# Altium schematic sheet AirLP.SchDoc
size A3
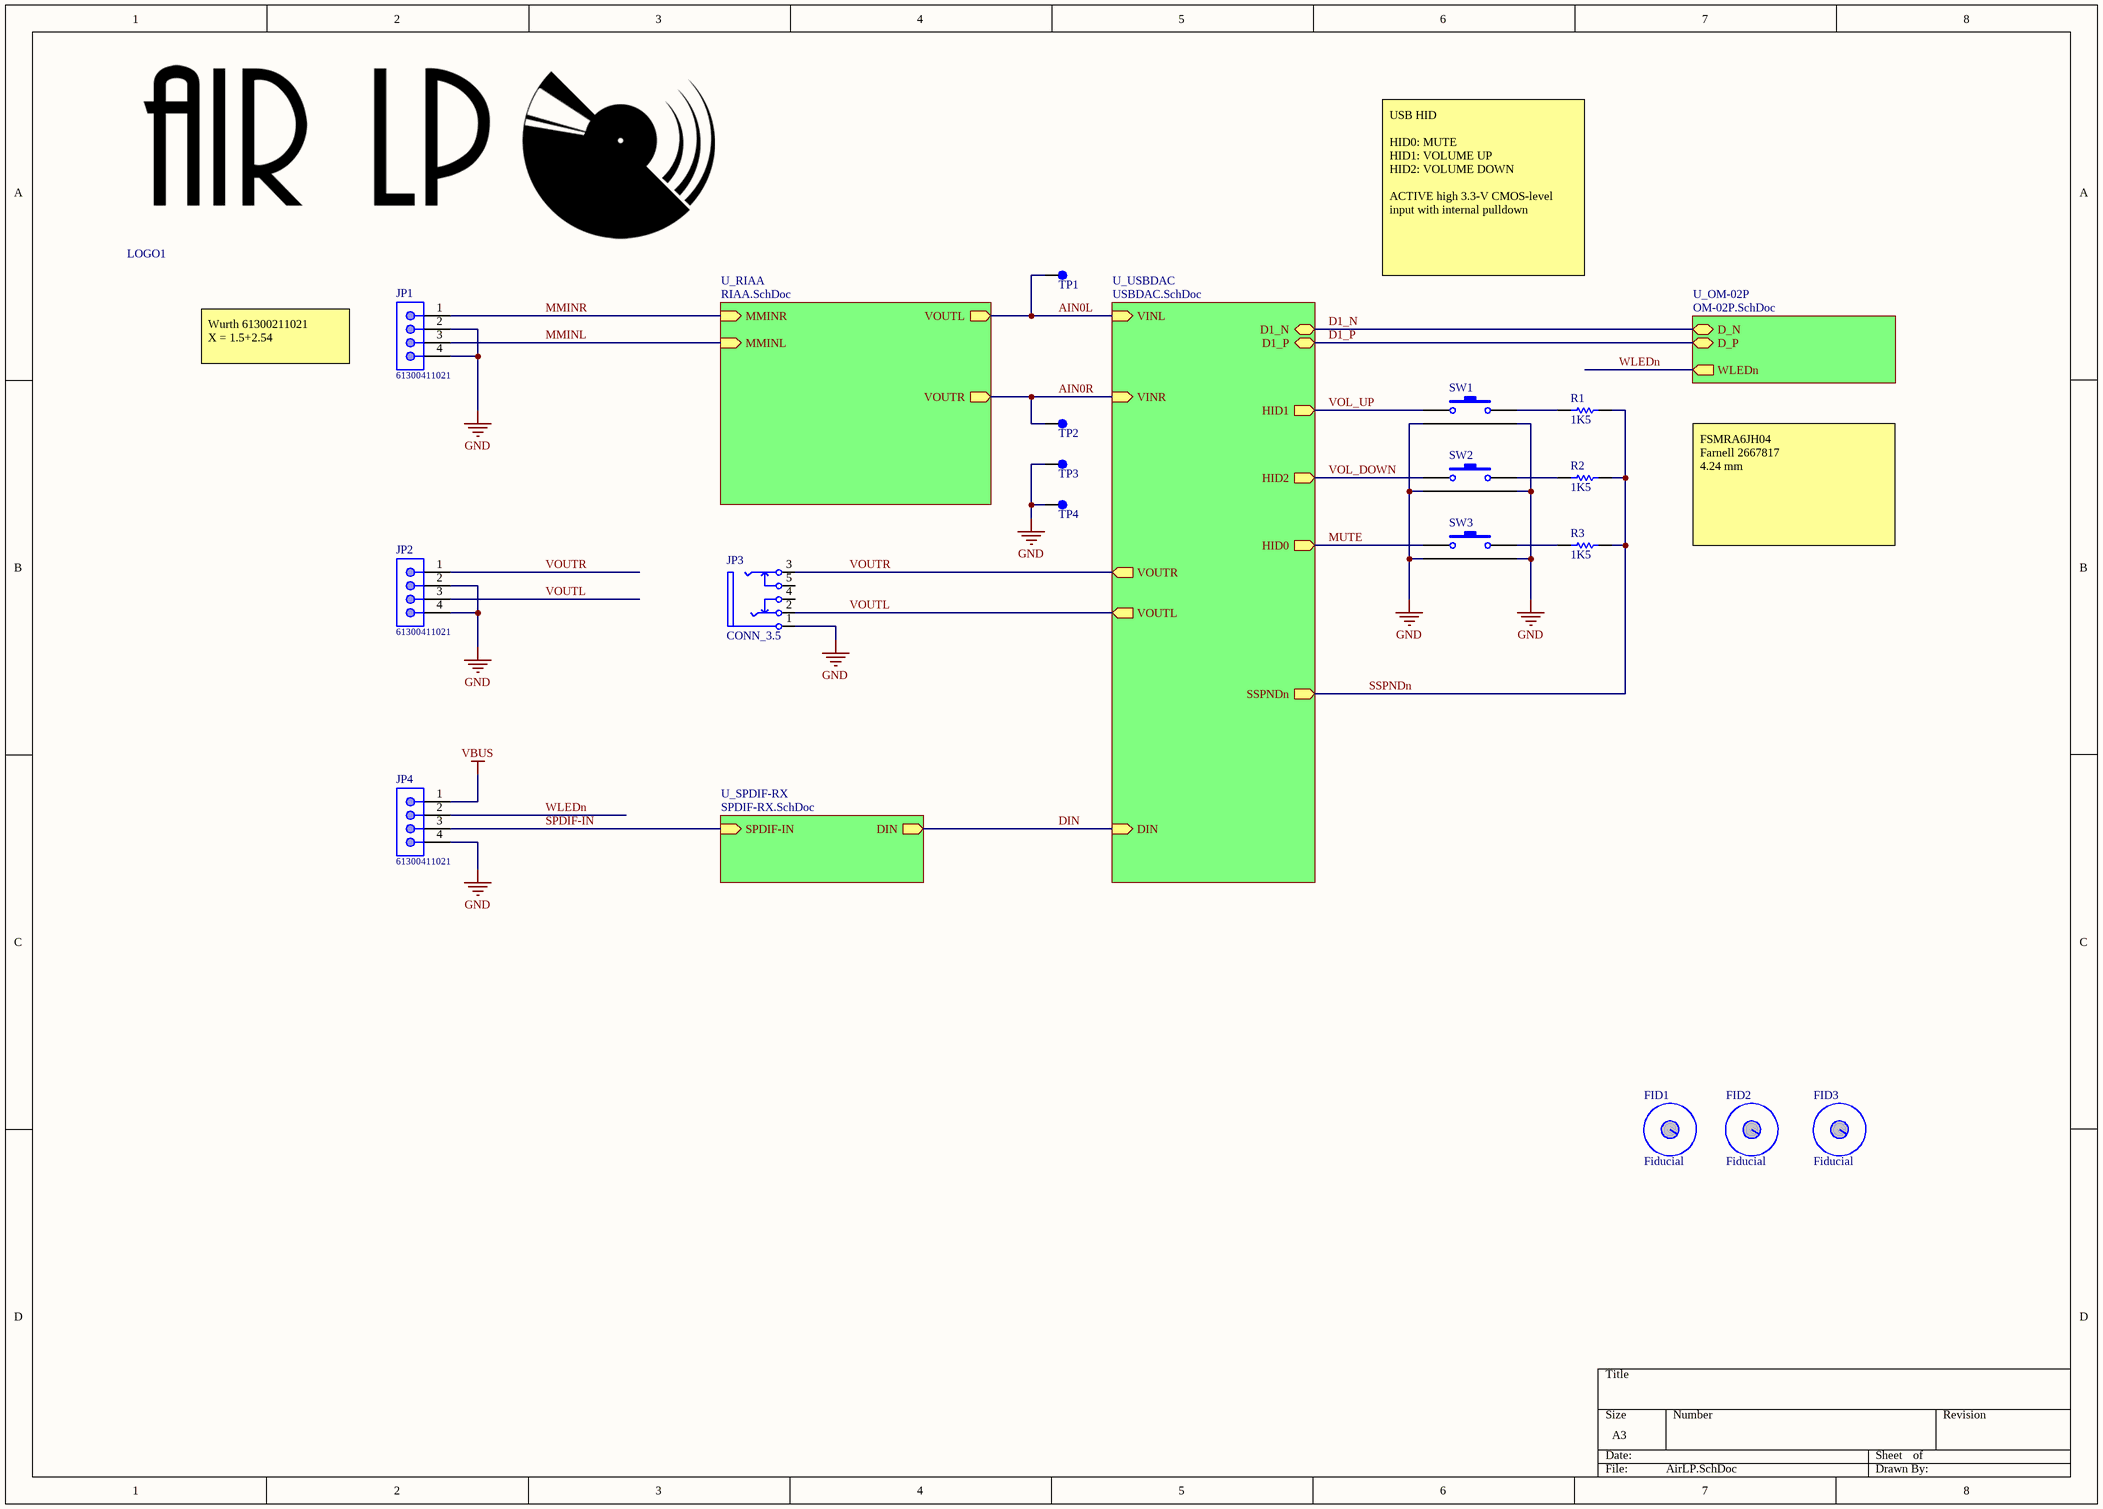
[diagram p0: AirLP.SchDoc]

## Parts
FID1  Fiducial  [MECH_FID_PLUS]  (no BOM)
FID2  Fiducial  [MECH_FID_PLUS]  (no BOM)
FID3  Fiducial  [MECH_FID_PLUS]  (no BOM)
JP1  61300411021  [61300411021]
JP2  61300411021  [61300411021]
JP3  CONN_3.5  [CONN-3.5_LUMBERG_1503_09]
JP4  61300411021  [61300411021]
LOGO1  LOGO-AIRLP  [LOGO-AIR-LP]  (value not drawn)  (no BOM)
R1  1K5  [RESC0805(2012)_L]
R2  1K5  [RESC0805(2012)_L]
R3  1K5  [RESC0805(2012)_L]
SW1  SW_TACT_FSMRA2JH  [SW_FSMRA2JH]  (value not drawn)
SW2  SW_TACT_FSMRA2JH  [SW_FSMRA2JH]  (value not drawn)
SW3  SW_TACT_FSMRA2JH  [SW_FSMRA2JH]  (value not drawn)
TP1  MECH_Testpoint  [MECH_TP_39_mil]  (value not drawn)  (no BOM)
TP2  MECH_Testpoint  [MECH_TP_39_mil]  (value not drawn)  (no BOM)
TP3  MECH_Testpoint  [MECH_TP_39_mil]  (value not drawn)  (no BOM)
TP4  MECH_Testpoint  [MECH_TP_39_mil]  (value not drawn)  (no BOM)

## Sub-sheets
U_OM-02P = OM-02P.SchDoc: D_P (bidir), D_N (bidir), WLEDn (out)
U_RIAA = RIAA.SchDoc: MMINL (in), MMINR (in), VOUTL (out), VOUTR (out)
U_SPDIF-RX = SPDIF-RX.SchDoc: SPDIF-IN (in), DIN (out)
U_USBDAC = USBDAC.SchDoc: VINL (in), VINR (in), VOUTL (out), VOUTR (out), SSPNDn (out), D1_P (bidir), D1_N (bidir), HID0 (out), HID1 (out), HID2 (out), DIN (in)

## Nets
GND: JP1.2 JP1.4 JP2.2 JP2.4 JP3.1(S) JP4.4 SW1.3 SW1.4 SW2.3 SW2.4 SW3.3 SW3.4 TP3.1(Pin1) TP4.1(Pin1)
VBUS: JP4.1
AIN0L: TP1.1(Pin1) ; sheet U_RIAA/VOUTL, sheet U_USBDAC/VINL
AIN0R: TP2.1(Pin1) ; sheet U_RIAA/VOUTR, sheet U_USBDAC/VINR
D1_N: sheet U_USBDAC/D1_N, sheet U_OM-02P/D_N
D1_P: sheet U_USBDAC/D1_P, sheet U_OM-02P/D_P
DIN: sheet U_USBDAC/DIN, sheet U_SPDIF-RX/DIN
MMINL: JP1.3 ; sheet U_RIAA/MMINL
MMINR: JP1.1 ; sheet U_RIAA/MMINR
MUTE: SW3.1 ; sheet U_USBDAC/HID0
SPDIF-IN: JP4.3 ; sheet U_SPDIF-RX/SPDIF-IN
SSPNDn: R1.2 R2.2 R3.2 ; sheet U_USBDAC/SSPNDn
VOL_DOWN: SW2.1 ; sheet U_USBDAC/HID2
VOL_UP: SW1.1 ; sheet U_USBDAC/HID1
VOUTL: JP2.3 JP3.2(T) ; sheet U_USBDAC/VOUTL
VOUTR: JP2.1 JP3.3(RN) ; sheet U_USBDAC/VOUTR
WLEDn: JP4.2 ; sheet U_OM-02P/WLEDn
NetR1_1: R1.1 SW1.2
NetR2_1: R2.1 SW2.2
NetR3_1: R3.1 SW3.2

Not connected (* = marked no-connect by the designer): JP3 4 5

## Notes on the sheet
- USB HID
  HID0:	MUTE
  HID1:	VOLUME UP
  HID2:	VOLUME DOWN
  ACTIVE high 3.3-V CMOS-level input with internal pulldown
- Wurth 61300211021
  X = 1.5+2.54
- FSMRA6JH04
  Farnell 2667817
  4.24 mm

## Library data of the parts
FID1-FID3 = MECH_FIDUCIAL_PLUS
JP1 JP2 JP4 = 61300411021: THT Angled Pin Header WR-PHD, Pitch 2.54 mm, Single Row, 4 pins; Pin Number: 4; Pitch: 2.54 mm; Gender: Male; Rated Current: 3 A; Working Voltage: 250 VAC; Withstanding Voltage: 500 VAC; Contact Resistance: 20 mOhm; ComponentLink1Description: Manufacturer; ComponentLink1URL: http://www.we-online.de; ComponentLink2Description: Datasheet; ComponentLink2URL: https://katalog.we-online.de/em/datasheet/6130xx11021.pdf; Part Number: 61300411021; Published Date: August 2018; Publisher: Wurth Elektronik; Operating Temperature: -40 to 105 degC; Mounting Technology: THT; Packaging: Bag; Row Number: Single; Orientation: Angled; MPN: 61300411021
JP3 = CONN_3.5_1503_09: Jack Socket, 3.5mm, Thru-Hole, Horizontal, 3-Conductor with Tip open & Ring closed; MPN: 1503 09; ELFA: 300-68-357; Farnell: 1243244
LOGO1 = LOGO-AIRLP: LOGO AIR LP
R1-R3 = RES_1K5_0805: 0805 1.5KΩ ±5% 1/8W; MPN: RC0805JR-071K5L; Power: 125mW; Tolerance: 5%; Value: 1K5
SW1-SW3 = SW_TACT_FSMRA2JH: SWITCH TACTILE SPST-NO 0.05A 12V; ELFA: 35-665-57; DigiKey: 450-1662-ND; Farnell: 1555987; MPN: FSMRA2JH
TP1-TP4 = MECH_Testpoint: Testpoint